# EAGLE design 3rd SCHEMATIC_EP (EAGLE 9.6.2)
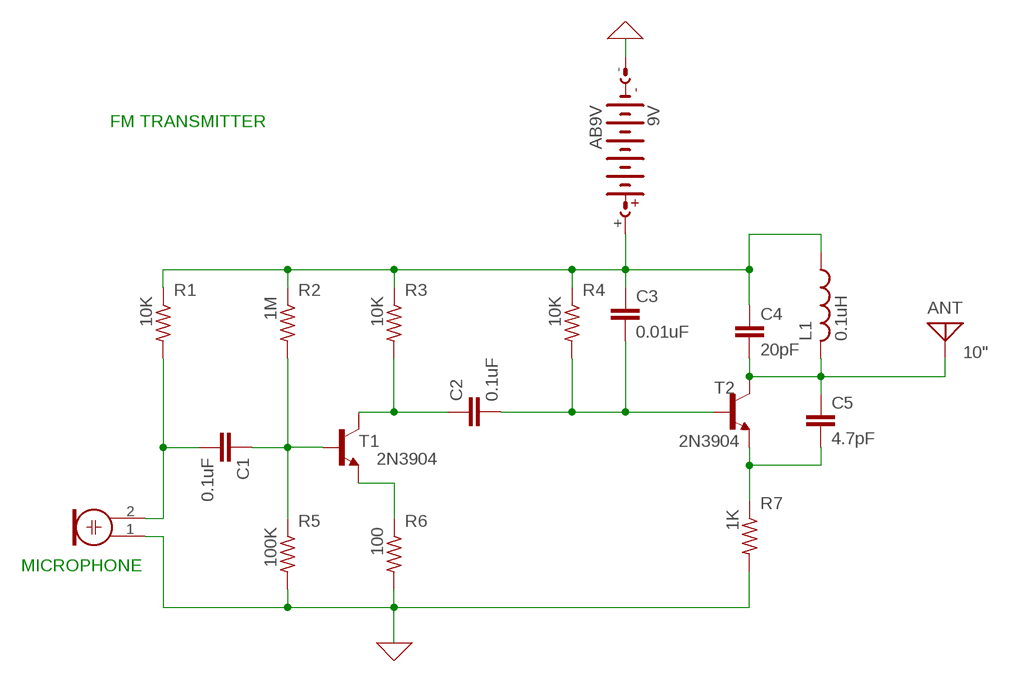
[diagram p0: schematic, sheet 1]

## Parts
9V  AB9V  [AB9V]
ANT  10"  ANTENNA  [PAD-01]
C1  0.1uF  C2.5/2  [C2.5-2]
C2  0.1uF  C2.5/2  [C2.5-2]
C3  0.01uF  C2.5/2  [C2.5-2]
C4  20pF  C2.5/2  [C2.5-2]
C5  4.7pF  C2.5/2  [C2.5-2]
L1  0.1uH  L-US0207/7  [0207/7]
MICROPHONE  ELECTRET_MICROPHON-F6050AP  [F6050AP]
R1  10K  R-US_R0603  [R0603]
R2  1M  R-US_R0603  [R0603]
R3  10K  R-US_R0603  [R0603]
R4  10K  R-US_R0603  [R0603]
R5  100K  R-US_R0603  [R0603]
R6  100  R-US_R0603  [R0603]
R7  1K  R-US_R0603  [R0603]
T1  2N3904  [TO92]
T2  2N3904  [TO92]

## Nets
0: 9V.- MICROPHONE.1 R5.2 R6.2 R7.2 ; supply symbol labelled GND
N$1: C1.1 R2.2 R5.1 T1.2(B)
N$2: R6.1 T1.3(E)
N$3: C2.1 R3.2 T1.1(C)
N$4: 9V.+ C3.1 C4.1 L1.1 R1.1 R2.1 R3.1 R4.1
N$5: C1.2 MICROPHONE.2 R1.2
N$7: C5.2 R7.1 T2.3(E)
N$8: C2.2 C3.2 R4.2 T2.2(B)
N$9: ANT.1 C4.2 C5.1 L1.2 T2.1(C)

## Notes on the sheet
- FM TRANSMITTER
- MICROPHONE

## Library data of the parts
9V = battery:AB9V: 9-V BATTERY CLIP
ANT = discrete:ANTENNA: Antenna
C1-C5 = capacitor-wima:C: CAPACITOR naming: grid - package width
L1 = rcl:L-US: INDUCTOR, American symbol; SPICEPREFIX: L
MICROPHONE = microphon:ELECTRET_MICROPHON-: Electret Condenser Microphone
R1-R7 = rcl:R-US_: RESISTOR, American symbol; SPICEPREFIX: R
T1 T2 = transistor:2N3904: NPN TRANSISTOR

## Board
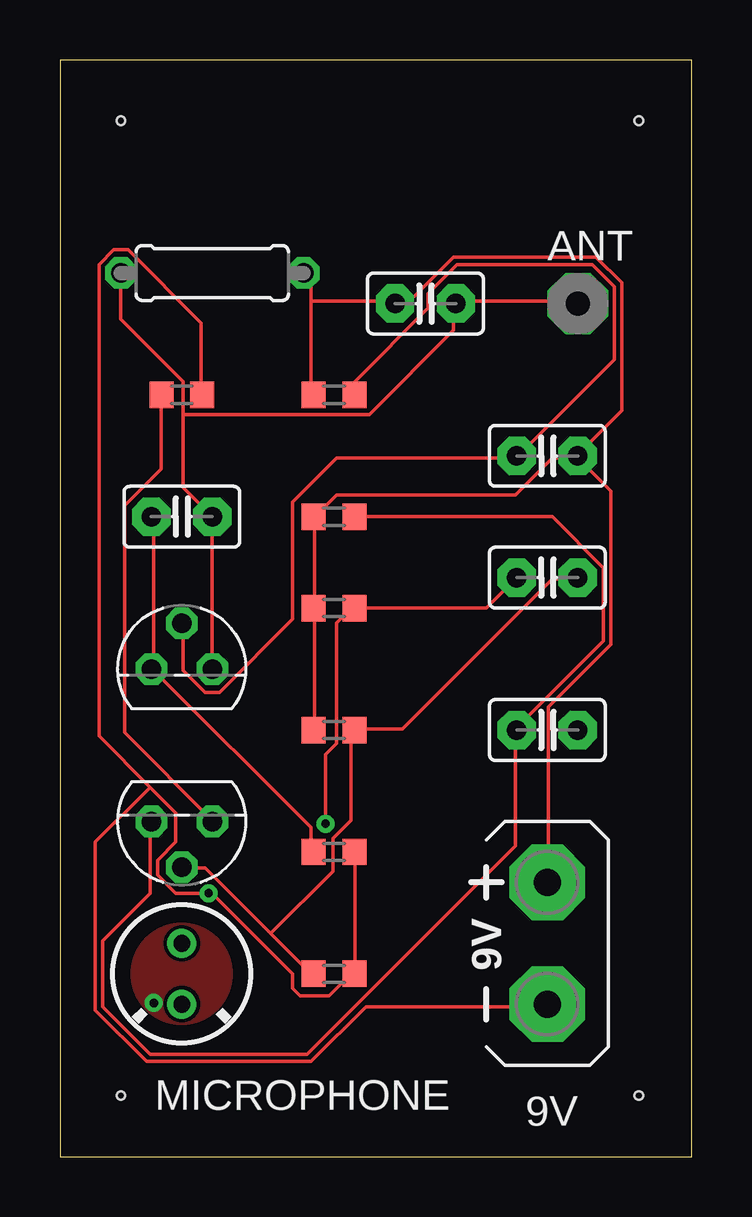
[diagram p1: board, top side]
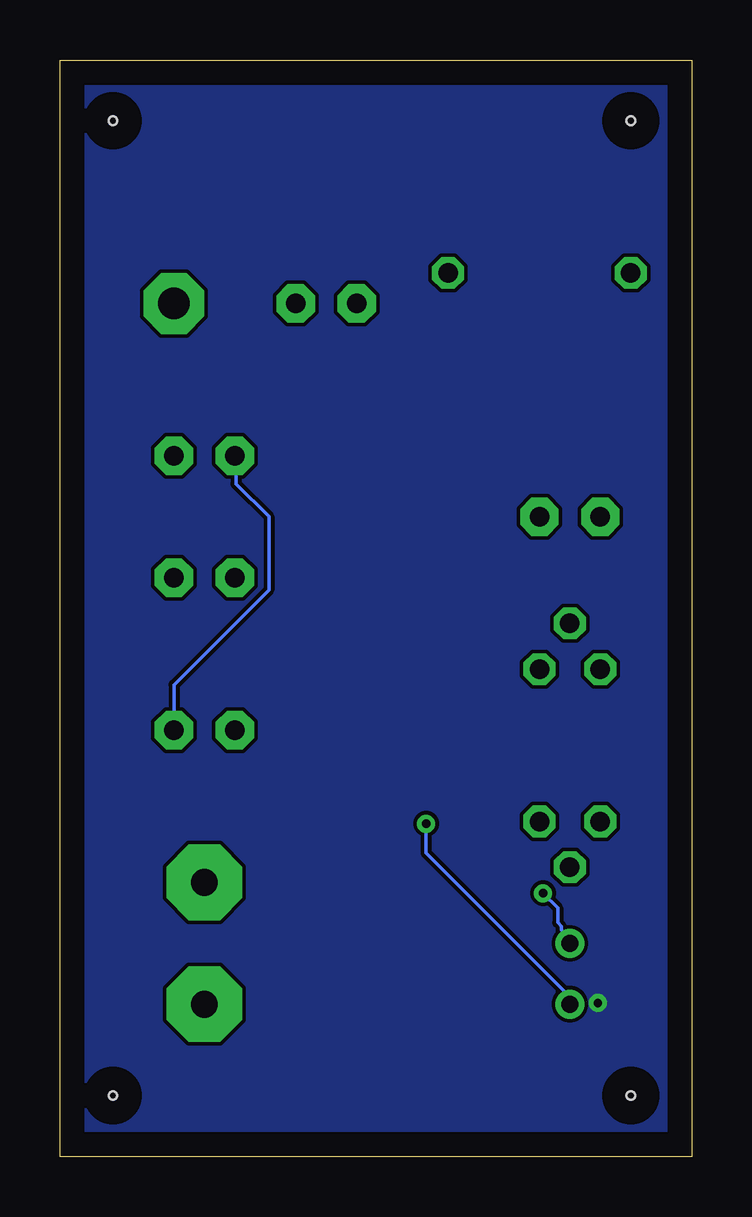
[diagram p2: board, bottom side, seen from below]

Size 26.34 x 45.71 mm. Coordinates in mm from the lower left corner, seen from the top.
Outline: 0,0 26.34,0 26.34,45.71 0,45.71 0,0
Copper layers (1*16): Top 0.035mm / dielectric 1.5mm / Bottom 0.035mm
Design rules "default": minimum track width 6mil, minimum drill 0.35mm, track to track 6mil, track to pad 6mil, pad to pad 6mil, via to via 6mil, smd to smd 6mil, copper to edge 40mil, drill to drill 6mil, minimum pad ring 10mil, minimum via ring 8mil, stop-mask expansion 4mil, vias tented up to drill 0mil, thermal gap 10mil
Holes 0.35 mm at 2.54,43.18 24.13,43.18 24.13,2.54 2.54,2.54

### Footprints (pad centres in the part's own frame; a part is rotated, then mirrored left to right if it is on the bottom)
AB9V = drill 1.118 pad 3.15 octagon: + 0,2.54; - 0,-2.54
PAD-01 = drill 1.321 pad 2.54 octagon: 1 0,0
C2.5-2 = drill 0.813 pad 1.6 octagon: 1 -1.27,0; 2 1.27,0
0207/7 = drill 0.813 octagon: 1 -3.81,0; 2 3.81,0
F6050AP = drill 0.7 pad 1.2: 1 0,1.27; 2 0,-1.27
R0603 = smd 1 x 1.1: 1 -0.85,0; 2 0.85,0
TO92 = drill 0.813 octagon: 1 1.27,0; 2 0,1.905; 3 -1.27,0

### Placement (x,y rotation side)
9V  20.32,8.89 0 top
ANT  21.59,35.56 0 top
C1  20.32,24.13 180 top
C2  20.32,17.78 0 top
C3  20.32,29.21 180 top
C4  15.24,35.56 0 top
C5  5.08,26.67 180 top
L1  6.35,36.83 180 top
MICROPHONE  5.08,7.62 0 top
R1  11.43,22.86 0 top
R2  11.43,17.78 0 top
R3  11.43,26.67 0 top
R4  11.43,31.75 0 top
R5  11.43,7.62 0 top
R6  5.08,31.75 0 top
R7  11.43,12.7 0 top
T1  5.08,13.97 180 top
T2  5.08,20.32 0 top

### Tracks (layer width: path | path; a pad name or v marks a point on that pad's centre or on a via)
0  (via drill 0.35)
  Top 0.152: R7.2 12.29,12.65 12.29,7.62 R5.2 12.14,7.62 11.23,6.71 10.01,6.71 9.7,7.01 9.7,7.62 6.35,10.97 v6.2,10.97 4.83,10.97 4.06,11.73 4.06,12.34 4.83,13.11 4.83,14.33 3.76,15.39 | 3.76,15.39 1.63,17.53 1.63,37.19 2.23,37.8 2.85,37.8 5.89,34.75 5.89,31.85 R6.2 | 3.76,15.39 1.47,13.11 1.47,6.1 3.61,3.96 10.46,3.96 12.75,6.25 20.22,6.25 9V.-
  Bottom 0.152: v6.2,10.97 5.59,10.36 5.59,9.75 5.44,9.6 5.44,9.45 5.13,9.14 5.13,8.99 MICROPHONE.1
GND  (via drill 0.35)
  other vias: 3.91,6.4
  pour Top: -1.27,46.99 -1.27,-1.27 27.94,-1.27 27.94,46.99
  pour Bottom: -2.54,48.26 -2.54,-2.54 29.21,-2.54 29.21,48.26
N$1
  Top 0.152: 8.79,9.3 6.04,12.04 5.13,12.04 T1.2 | 8.79,9.3 10.46,7.62 R5.1 | 8.79,9.3 11.38,11.89 11.38,13.26 12.14,14.02 12.14,17.68 R2.2 12.29,17.83 14.28,17.83 20.52,24.08 21.59,24.08 C1.1
N$2
  Top 0.152: R6.1 4.22,31.7 4.22,28.65 2.69,27.13 2.69,17.68 6.35,14.02 T1.3
N$3
  Top 0.152: R3.2 20.52,26.67 22.66,24.54 22.66,21.49 19,17.83 C2.1 19,17.68 19,12.95 10.31,4.27 3.76,4.27 1.78,6.25 1.78,8.99 3.76,10.97 3.76,13.87 T1.1
N$4
  Top 0.152: 10.46,35.66 10.46,36.42 10.16,36.73 L1.1 | 10.46,35.66 10.46,31.85 R4.1 | 10.46,35.66 13.97,35.66 | 10.62,22.86 10.62,17.83 R2.1 | 10.62,22.86 10.62,26.67 | 10.62,22.86 R1.1 | 21.59,29.11 20.52,29.11 19,27.58 11.53,27.58 10.62,26.67 | 10.62,26.67 R3.1 | 13.97,35.66 14.58,35.66 16.41,37.49 22.35,37.49 23.42,36.42 23.42,31.09 21.59,29.26 C3.1 21.59,29.11 | 13.97,35.66 C4.1 | 21.59,29.11 22.96,27.74 22.96,21.34 20.37,18.75 20.37,11.43 9V.+
N$5  (via drill 0.35)
  Top 0.152: C1.2 17.78,22.86 R1.2 12.14,22.86 11.53,22.25 11.53,17.22 11.07,16.76 v11.07,13.87
  Bottom 0.152: v11.07,13.87 11.07,12.65 5.13,6.71 5.13,6.4 MICROPHONE.2
N$7
  Top 0.152: R7.1 10.46,12.8 10.46,13.72 3.91,20.27 T2.3 3.91,20.42 3.91,26.67 C5.2
N$8
  Top 0.152: R4.2 12.29,31.85 12.29,32.31 15.34,35.36 15.34,35.97 16.56,37.19 22.2,37.19 23.11,36.27 23.11,33.22 19.15,29.26 C3.2 19,29.11 11.53,29.11 9.7,27.28 9.7,22.4 6.65,19.36 6.04,19.36 5.13,20.27 5.13,22.1 T2.2
  Bottom 0.152: C2.2 21.59,19.66 17.63,23.62 17.63,26.67 19,28.04 19,29.11 C3.2
N$9
  Top 0.152: ANT.1 21.59,35.66 16.56,35.66 C4.2 16.41,35.51 16.41,34.44 12.9,30.94 5.13,30.94 | L1.2 2.54,34.9 5.13,32.31 5.13,30.94 | 5.13,30.94 5.13,27.89 C5.1 T2.1